# Altium schematic sheet HUZZAH32.SchDoc: ADAFRUIT HUZZAH32 feather
size A2; DocumentNumber: 1/1; Revision: v1.0; SheetNumber: 1; SheetTotal: 1
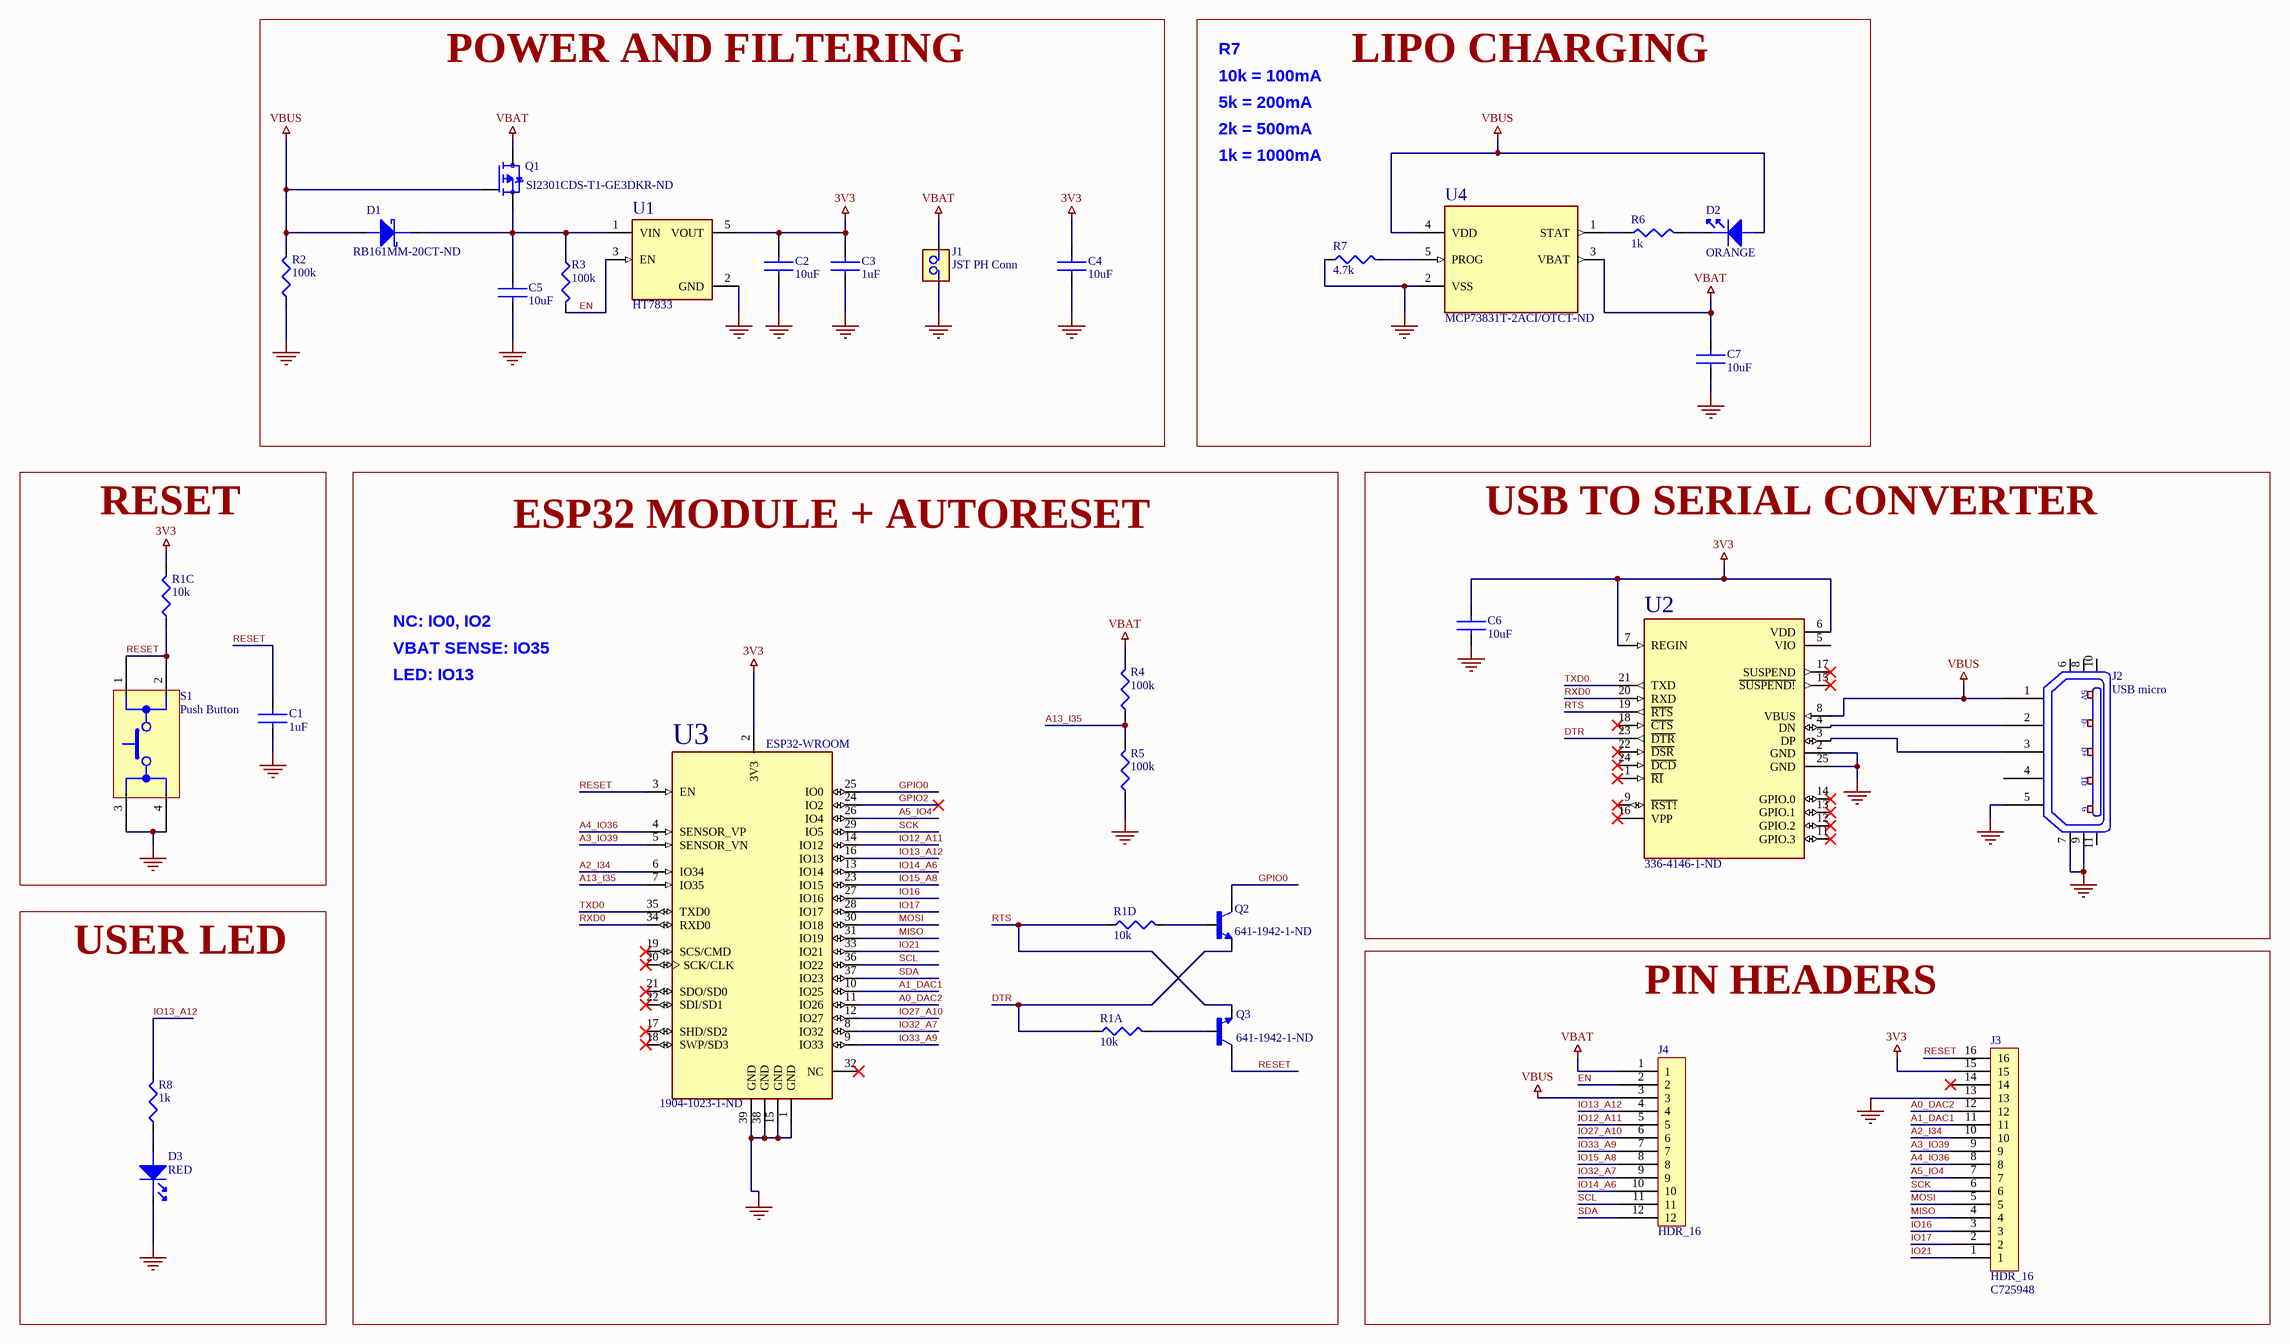
[diagram p0: HUZZAH32.SchDoc]

## Parts
C1  1uF  [Ceramic_0805]
C2  10uF  [Ceramic_0805]
C3  1uF  [Ceramic_0805]
C4  10uF  [Ceramic_0805]
C5  10uF  [Ceramic_0805]
C6  10uF  [Ceramic_0805]
C7  10uF  [Ceramic_0805]
D1  Schottky  [SOD-123F]  (value not drawn)
D2  ORANGE  [LED_0805]
D3  RED  [LED_0805]
J1  JST PH Conn  [JST_PH_CONN_F_SMD]
J2  USB micro  [USB_CONN]
J3  HDR_16  Supplier Part Number 1: C725948  [HDR_16]
J4  HDR_16  [HDR_12]
Q1  P Channel MOSFET  [SOT23-3]  (value not drawn)
Q2  Supplier Part Number 2: 641-1942-1-ND  [SOT23-3]  (hidden comment: BJT)
Q3  Supplier Part Number 2: 641-1942-1-ND  [SOT23-3]  (hidden comment: BJT)
R1  10k  [SMD_4_RES_ARRAY_1206]  (parts A,C,D of 4)
R2  100k  [R_0603]
R3  100k  [R_0603]
R4  100k  [R_0603]
R5  100k  [R_0603]
R6  1k  [R_0603]
R7  4.7k  [R_0603]
R8  1k  [R_0603]
S1  Push Button  [SW_PB_6643]
U1  HT7833  [SOT23-5]
U2  USB to UART converter  [QFN_24]  (value not drawn)
U3  ESP32-WROOM  [ESP32_WROOM_module]
U4  IC BATT Conctroller  [SOT23-5]  (value not drawn)

## Blocks framed on the sheet
POWER AND FILTERING: C2-C5 D1 J1 Q1 R2 R3 U1
LIPO CHARGING: C7 D2 R6 R7 U4
RESET: C1 R1 S1
ESP32 MODULE + AUTORESET: Q2 Q3 R1 R4 R5 U3
USB TO SERIAL CONVERTER: C6 J2 U2
USER LED: D3 R8
PIN HEADERS: J3 J4

## Nets
3V3: C2.2 C3.2 C4.2 C6.1 J3.15 R1.5 U1.5(VOUT) U2.6(VDD) U2.7(REGIN) U3.2(3V3)
GND: C1.1 C2.1 C3.1 C4.1 C5.1 C6.2 C7.1 D3.2(C) J1.1 J2.5(GND) J2.7 J2.9 J3.13 R2.1 R5.1 R7.1 S1.3 S1.4 U1.2(GND) U2.2(GND) U2.25(GND) U3.1(GND) U3.15(GND) U3.38(GND) U3.39(GND) U4.2(VSS)
VBAT: C7.2 J1.2 J4.1 Q1.3(D) R4.2 U4.3(VBAT)
VBUS: D1.1(A) D2.2(Anode) J2.1(VBUS) J4.3 Q1.1(G) R2.2 U2.8(VBUS) U4.4(VDD)
A0_DAC2: J3.12 U3.11(IO26)
A1_DAC1: J3.11 U3.10(IO25)
A2_I34: J3.10 U3.6(IO34)
A3_IO39: J3.9 U3.5(SENSOR_VN)
A4_IO36: J3.8 U3.4(SENSOR_VP)
A5_IO4: J3.7 U3.26(IO4)
A13_I35: R4.1 R5.2 U3.7(IO35)
DTR: Q2.2(E) R1.2 U2.23(~{DTR})
EN: J4.2 R3.2 U1.3(EN)
GPIO0: Q2.3(C) U3.25(IO0)
GPIO2: U3.24(IO2)
IO12_A11: J4.5 U3.14(IO12)
IO13_A12: J4.4 R8.2 U3.16(IO13)
IO14_A6: J4.10 U3.13(IO14)
IO15_A8: J4.8 U3.23(IO15)
IO16: J3.3 U3.27(IO16)
IO17: J3.2 U3.28(IO17)
IO21: J3.1 U3.33(IO21)
IO27_A10: J4.6 U3.12(IO27)
IO32_A7: J4.9 U3.8(IO32)
IO33_A9: J4.7 U3.9(IO33)
MISO: J3.4 U3.31(IO19)
MOSI: J3.5 U3.30(IO18)
RESET: C1.2 J3.16 Q3.3(C) R1.6 S1.1 S1.2 U3.3(EN)
RTS: Q3.2(E) R1.8 U2.19(~{RTS})
RXD0: U2.20(RXD) U3.34(RXD0)
SCK: J3.6 U3.29(IO5)
SCL: J4.11 U3.36(IO22)
SDA: J4.12 U3.37(IO23)
TXD0: U2.21(TXD) U3.35(TXD0)
NetC5_2: C5.2 D1.2(C) Q1.2(S) R3.1 U1.1(VIN)
NetD2_1: D2.1(Cathode) R6.2
NetD3_1: D3.1(A) R8.1
NetJ2_2: J2.2(D-) U2.4(DN)
NetJ2_3: J2.3(D+) U2.3(DP)
NetQ2_1: Q2.1(B) R1.7
NetQ3_1: Q3.1(B) R1.1
NetR6_1: R6.1 U4.1(STAT)
NetR7_2: R7.2 U4.5(PROG)

Not connected (* = marked no-connect by the designer): J2 4(ID) 6 8 10 11; J3 14*; U2 1(~{RI})* 5(VIO) 9(~{RST!})* 11(GPIO.3)* 12(GPIO.2)* 13(GPIO.1)* 14(GPIO.0)* 15(~{SUSPEND!})* 16(VPP)* 17(SUSPEND)* 18(~{CTS})* 22(~{DSR})* 24(~{DCD})*; U3 17(SHD/SD2)* 18(SWP/SD3)* 19(SCS/CMD)* 20(SCK/CLK)* 21(SDO/SD0)* 22(SDI/SD1)* 32(NC)*

## Notes on the sheet
- 10k = 100mA
- R7
- 5k = 200mA
- 2k = 500mA
- 1k = 1000mA
- NC: IO0, IO2
- VBAT SENSE: IO35
- LED: IO13
- Title
- Size:
- Date:
- File:
- A2
- Number:
- Time:
- Revision:
- Sheet
- of
- (in symbol USB micro) 5V; G

## Library data of the parts
C1 C3 = 1276-1026-1-ND: 1uF 16V ±10% 0805 MLCC; Supplier 1: LCSC; ComponentLink1Description: LCSC link 1; ComponentLink1URL: https://lcsc.com/product-detail/Multilayer-Ceramic-Capacitors-MLCC-SMD-SMT_Samsung-Electro-Mechanics-CL21B105KOFNNNE_C24123.html; Supplier Part Number 1: C24123; Supplier 2: Digi-Key; Supplier Part Number 2: 1276-1026-1-ND
C2 C4-C7 = 1276-1096-1-ND: 1uF 16V ±10% 0805 MLCC; Supplier 1: LCSC; ComponentLink1Description: LCSC link 1; ComponentLink1URL: https://lcsc.com/product-detail/Multilayer-Ceramic-Capacitors-MLCC-SMD-SMT_Samsung-Electro-Mechanics-CL21A106KOQNNNE_C1713.html; Supplier Part Number 1: C1713; Supplier 2: Digi-Key; Supplier Part Number 2: 1276-1096-1-ND
D1 = RB161MM-20CT-ND: Diode Schottky 20 V 1A Surface Mount SOD-123FL; Supplier 1: LCSC; ComponentLink1Description: LCSC link 1; ComponentLink1URL: https://lcsc.com/product-detail/Schottky-Barrier-Diodes-SBD_ROHM-Semicon-RB161MM-20TR_C123070.html; Supplier Part Number 1: C123070; Supplier 2: Digi-Key; Supplier Part Number 2: RB161MM-20CT-ND
D2 = LED_ORANGE: LED ORANGE 20mA 2V 0805; Supplier 1: LCSC; ComponentLink1Description: LCSC link 1; ComponentLink1URL: https://lcsc.com/product-detail/Light-Emitting-Diodes-LED_Lite-On-LTST-C170KFKT_C284931.html; Supplier Part Number 1: C284931
D3 = LED_RED: LED RED 20mA 2V 0805; Supplier 1: LCSC; Supplier Part Number 1: C72037; ComponentLink1Description: LCSC link 1; ComponentLink1URL: https://lcsc.com/product-detail/Light-Emitting-Diodes-LED_Everlight-Elec-17-21SURC-S530-A3-TR8_C72037.html
J1 = JST-PH: 1x2 JST PH 2mm SMD Connector; Suplier Part Number 3: C2688784; Suplier Part Number 4: C278789; ComponentLink1Description: LCSC link 1; ComponentLink1URL: https://www.lcsc.com/product-detail/Wire-To-Board-Wire-To-Wire-Connector_BOOMELE-Boom-Precision-Elec-C47647_C47647.html; Supplier 1: LCSC; Supplier Part Number 1: C47647; ComponentLink2Description: LCSC link 2; ComponentLink2URL: https://www.lcsc.com/product-detail/Wire-To-Board-Wire-To-Wire-Connector_HX-Zhejiang-Yueqing-Hongxing-Elec-HX20007-2AWB_C442222.html; Supplier Part Number 2: C442222; Supplier 3: LCSC; ComponentLink3Description: LCSC link 3; ComponentLink3URL: https://www.lcsc.com/product-detail/Wire-To-Board-Wire-To-Wire-Connector_Shenzhen-Kinghelm-Elec-KH-A2001WF-02A_C2688784.html; ComponentLink4Description: New link; ComponentLink4URL: https://lcsc.com/product-detail/Wire-To-Board-Wire-To-Wire-Connector_HR-Joint-Tech-Elec-A2001WR-S-02PD01_C278789.html; Supplier 4: LCSC; Supplier 2: LCSC
J3 = HDR_16: HEADER male 1x16 2.54mm; ComponentLink1Description: LCSC link 1; ComponentLink1URL: https://lcsc.com/product-detail/Pin-Headers_XKB-Connectivity-X6511WV-16H-C30D60_C725948.html; Supplier 1: LCSC
J4 = HDR_12: HEADER male 1x12 2.54mm; ComponentLink1Description: LCSC link 1; ComponentLink1URL: https://lcsc.com/product-detail/Pin-Headers_CJT-Changjiang-Connectors-A2541WV-12P_C225487.html; Supplier 1: LCSC; Supplier Part Number 1: C225487
Q1 = SI2301CDS-T1-GE3DKR-ND: P Channel MOSFET 20V 3.1A 860mW 112mΩ@4.5V SOT-23-3; Supplier 1: LCSC; ComponentLink1Description: LCSC link 1; ComponentLink1URL: https://lcsc.com/product-detail/MOSFETs_Vishay-Intertech-SI2301CDS-T1-GE3_C10487.html; Supplier Part Number 1: C10487; Supplier 2: Digi-Key; Supplier Part Number 2: SI2301CDS-T1-GE3DKR-ND
Q2 Q3 = MMBT2222A: BJT NPN 40 V 600 mA 300MHz 300 mW SOT-23-3; Supplier 1: LCSC; ComponentLink1Description: LCSC link 1; ComponentLink1URL: https://lcsc.com/product-detail/Bipolar-Transistors-BJT_Changjiang-Electronics-Tech-CJ-MMBT2222A-1P_C8512.html; Supplier Part Number 1: C8512; Supplier 2: Digi-Key
R1 = EXB-38V104JV: 4 Resistor Array 10kΩ ±5% 1/16W 1206; Supplier 1: LCSC; ComponentLink1Description: LCSC link 1; ComponentLink1URL: https://lcsc.com/product-detail/Resistor-Networks-Arrays_UNI-ROYAL-Uniroyal-Elec-4D03WGJ0103T5E_C29718.html; Supplier Part Number 1: C29718; Supplier 2: Digi-Key; Supplier Part Number 2: Y9104CT-ND
R2-R5 = 0603WAJ0104T5E: RES SMD 100kΩ 5% 1/10W 0603; ComponentLink1Description: LCSC link 1; ComponentLink1URL: https://lcsc.com/product-detail/Chip-Resistor-Surface-Mount_UNI-ROYAL-Uniroyal-Elec-0603WAJ0104T5E_C15458.html; Supplier 1: LCSC; Supplier Part Number 1: C15458
R6 R8 = 0603WAJ0102T5E: RES SMD 1kΩ 5% 1/10W 0603; ComponentLink1Description: LCSC link 1; ComponentLink1URL: https://lcsc.com/product-detail/Chip-Resistor-Surface-Mount_UNI-ROYAL-Uniroyal-Elec-0603WAJ0102T5E_C25585.html; Supplier 1: LCSC; Supplier Part Number 1: C25585
R7 = 0603WAF4701T5E: RES SMD 4.7kΩ 1% 1/10W 0603; ComponentLink1Description: LCSC link 1; ComponentLink1URL: https://lcsc.com/product-detail/Chip-Resistor-Surface-Mount_UNI-ROYAL-Uniroyal-Elec-0603WAF4701T5E_C23162.html; Supplier 1: LCSC; Supplier Part Number 1: C23162
S1 = GT-TC089B-H043-L1: SPST tactile switch SMD 6x6x4.3mm; ComponentLink1Description: LCSC link 1; ComponentLink1URL: https://lcsc.com/product-detail/Tactile-Switches_XKB-Connectivity-TS-1145A-B-A_C318904.html; Supplier 1: LCSC; Supplier Part Number 1: C318904
U1 = HT7833: Linear Voltage Regulator IC Positive Fixed 3V3 Output 500mA 500mV@(500mA) SOT-23-5; ComponentLink1Description: LCSC link 1; ComponentLink1URL: https://lcsc.com/product-detail/Linear-Voltage-Regulators-LDO_Holtek-Semicon-HT7833_C164106.html; Supplier 1: LCSC; Supplier Part Number 1: C164106
U2 = 336-4146-1-ND: USB Bridge, USB to UART USB 2.0 UART Interface; Supplier 1: LCSC; Supplier Part Number 1: C47742; ComponentLink1Description: LCSC link 1; ComponentLink1URL: https://lcsc.com/product-detail/USB-ICs_SILICON-LABS-CP2104-F03-GMR_C47742.html; Supplier 2: Digi-Key; Supplier Part Number 2: 336-4146-1-ND
U3 = 1904-1023-1-ND: BT, WiFi 802.11b/g/n, BT v4.2 +EDR, Class 1, 2 and 3 Transceiver Module 2.4GHz ~ 2.5GHz Integrated, Trace Surface Mount; Supplier 1: LCSC; Supplier 2: LCSC; Supplier Part Number 1: C82899; ComponentLink1Description: LCSC link 1; ComponentLink1URL: https://lcsc.com/product-detail/WiFi-Modules_Espressif-Systems-ESP32-WROOM-32_C82899.html; ComponentLink2Description: LCSC link 2; ComponentLink2URL: https://lcsc.com/product-detail/WiFi-Modules_Espressif-Systems-ESP32-WROOM-32D_C473012.html; Supplier Part Number 2: C473012; Supplier 3: Digi-Key; Supplier 4: Digi-Key; Supplier Part Number 3: 1965-ESP32-WROOM-32E-N4TR-ND; Supplier Part Number 4: 1904-1023-1-ND
U4 = MCP73831T-2ACI/OTCT-ND: Charger IC Lithium Ion/Polymer SOT-23-5 4.2V 500mA; Supplier 1: LCSC; ComponentLink1Description: LCSC link 1; ComponentLink1URL: C23162; Supplier Part Number 1: C424093; Supplier 2: Digi-Key; Supplier Part Number 2: MCP73831T-2ACI/OTCT-ND
J2 = USB micro: ComponentLink1Description: LCSC link 1; ComponentLink1URL: https://lcsc.com/product-detail/USB-Connectors_Jing-Extension-of-the-Electronic-Co-920-A52A2021S10104_C40951.html; Supplier 1: LCSC; Supplier Part Number 1: C40951